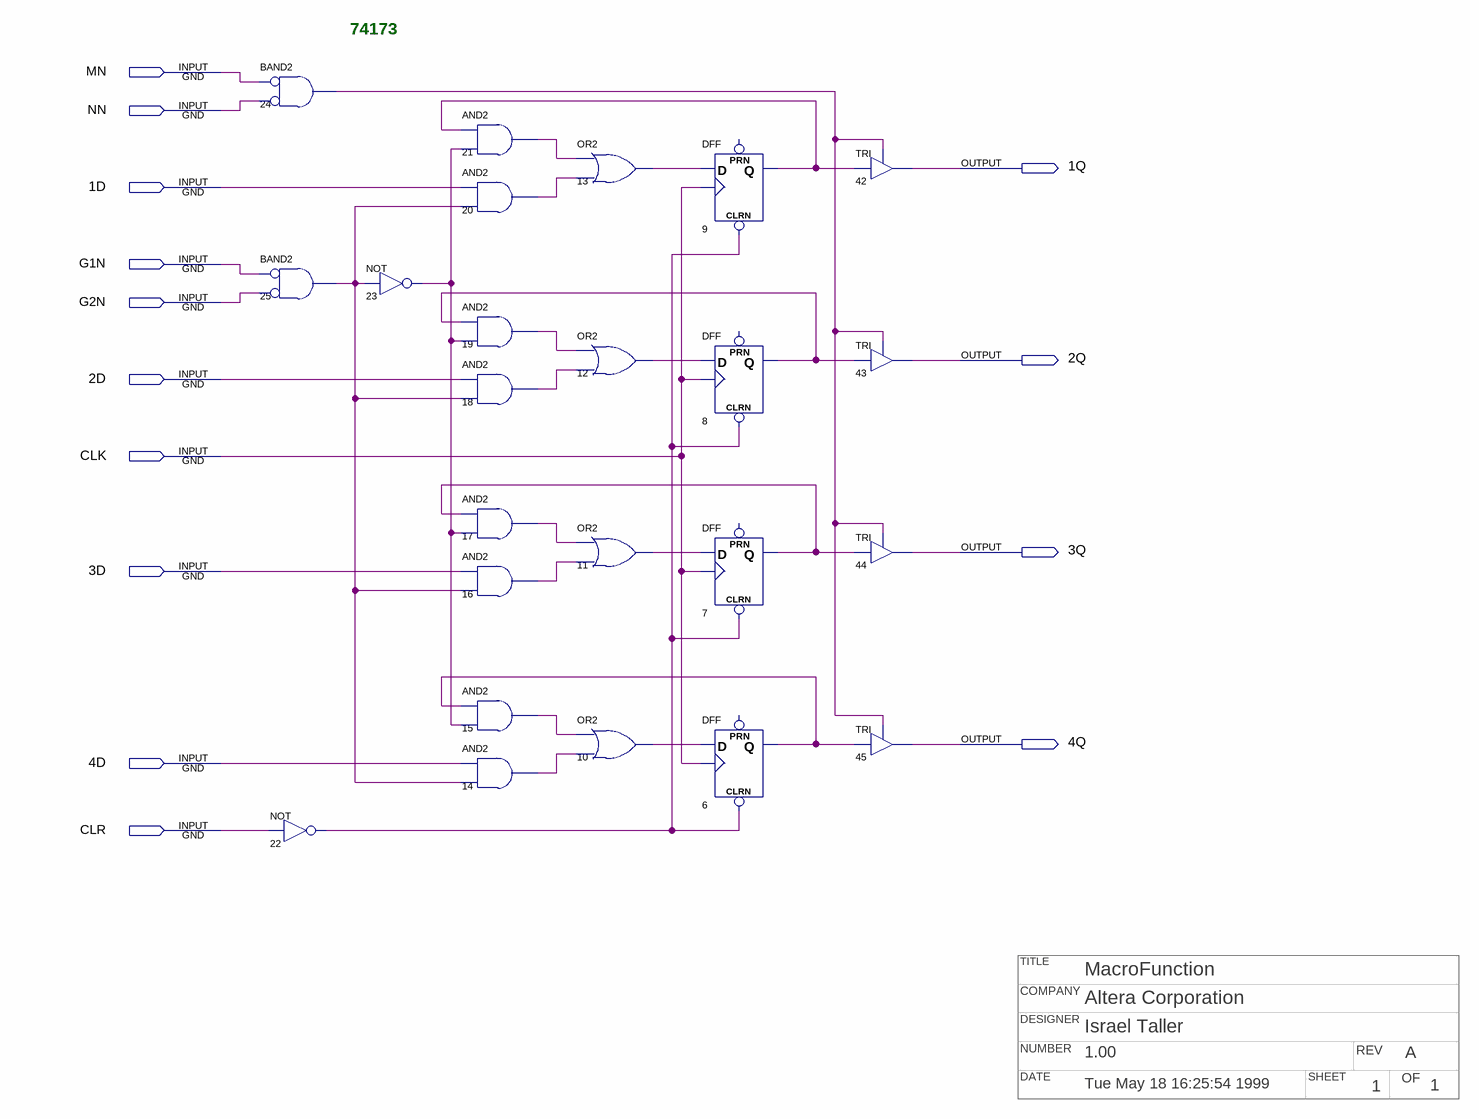
[diagram p0: schematic sheet]
// Quartus schematic 74173.bdf as structural Verilog: 24 symbols, 14 pins
// Title block: TITLE: MacroFunction; COMPANY: Altera Corporation; DESIGNER: Israel Taller; NUMBER: 1.00; REV: A; DATE: Tue May 18 16:25:54 1999; SHEET: 1; OF: 1
module \74173  (
  input  MN,
  input  NN,
  input  \1D ,
  input  G1N,
  input  G2N,
  input  \2D ,
  input  CLK,
  input  \3D ,
  input  \4D ,
  input  CLR,
  output \1Q ,
  output \2Q ,
  output \3Q ,
  output \4Q 
);

  wire n6_q, n7_q, n8_q, n9_q, n10_out, n11_out, n12_out, n13_out, n14_out, n15_out, n16_out, n17_out,
       n18_out, n19_out, n20_out, n21_out, n22_out, n23_out, n24_out, n25_out;

  and u_24 (n24_out, ~MN, ~NN);  // BAND2
  and u_25 (n25_out, ~G1N, ~G2N);  // BAND2
  not u_22 (n22_out, CLR);
  not u_23 (n23_out, n25_out);
  and u_21 (n21_out, n9_q, n23_out);
  and u_20 (n20_out, \1D , n25_out);
  and u_19 (n19_out, n8_q, n23_out);
  and u_18 (n18_out, \2D , n25_out);
  and u_17 (n17_out, n7_q, n23_out);
  and u_16 (n16_out, \3D , n25_out);
  and u_15 (n15_out, n6_q, n23_out);
  and u_14 (n14_out, \4D , n25_out);
  or u_13 (n13_out, n21_out, n20_out);
  or u_12 (n12_out, n19_out, n18_out);
  or u_11 (n11_out, n17_out, n16_out);
  or u_10 (n10_out, n15_out, n14_out);
  DFF u_9 (.CLRN(n22_out), .CLK(CLK), .D(n13_out), .Q(n9_q));  // open: PRN
  DFF u_8 (.CLRN(n22_out), .CLK(CLK), .D(n12_out), .Q(n8_q));  // open: PRN
  DFF u_7 (.CLRN(n22_out), .CLK(CLK), .D(n11_out), .Q(n7_q));  // open: PRN
  DFF u_6 (.CLRN(n22_out), .CLK(CLK), .D(n10_out), .Q(n6_q));  // open: PRN
  TRI u_42 (.IN(n9_q), .OE(n24_out), .OUT(\1Q ));
  TRI u_43 (.IN(n8_q), .OE(n24_out), .OUT(\2Q ));
  TRI u_44 (.IN(n7_q), .OE(n24_out), .OUT(\3Q ));
  TRI u_45 (.IN(n6_q), .OE(n24_out), .OUT(\4Q ));

  // Notes on the sheet:
  //   74173
endmodule
